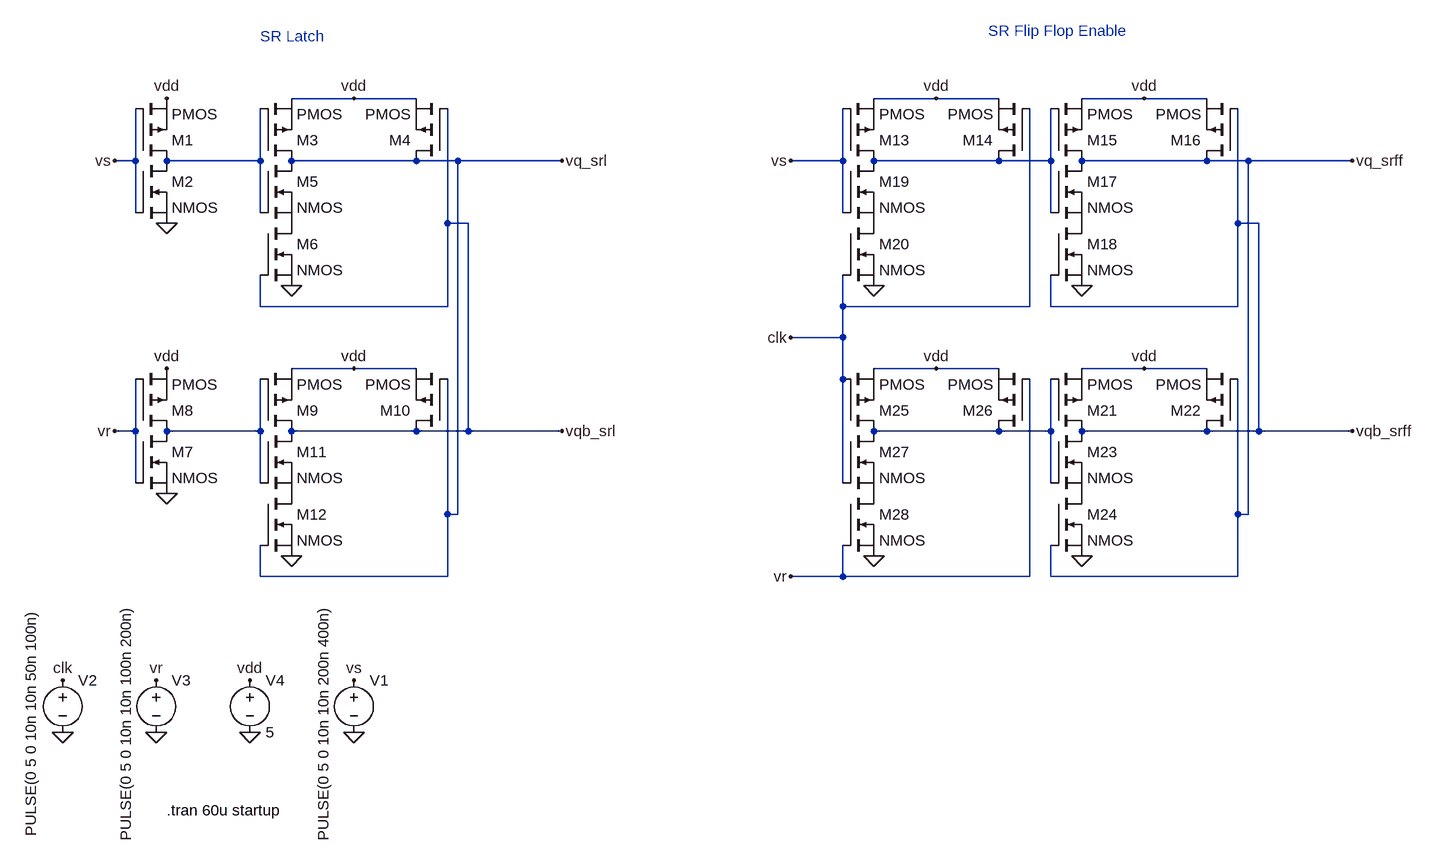
[diagram p0: schematic Basic Memory Device.asc]
Basic Memory Device.asc, the LTspice schematic file:
Version 4.1
SHEET 1 3060 1216
WIRE 336 48 240 48
WIRE 432 48 336 48
WIRE 1232 48 1136 48
WIRE 1328 48 1232 48
WIRE 1552 48 1456 48
WIRE 1648 48 1552 48
WIRE 0 144 0 64
WIRE 0 144 -32 144
WIRE 192 144 192 64
WIRE 192 144 48 144
WIRE 432 144 240 144
WIRE 496 144 432 144
WIRE 656 144 496 144
WIRE 1088 144 1088 64
WIRE 1088 144 1008 144
WIRE 1328 144 1136 144
WIRE 1408 144 1408 64
WIRE 1408 144 1328 144
WIRE 1648 144 1456 144
WIRE 1712 144 1648 144
WIRE 1872 144 1712 144
WIRE 0 224 0 144
WIRE 192 224 192 144
WIRE 1088 224 1088 144
WIRE 1408 224 1408 144
WIRE 480 240 480 64
WIRE 512 240 480 240
WIRE 1696 240 1696 64
WIRE 1728 240 1696 240
WIRE 192 368 192 320
WIRE 480 368 480 240
WIRE 480 368 192 368
WIRE 1088 368 1088 320
WIRE 1376 368 1376 64
WIRE 1376 368 1088 368
WIRE 1408 368 1408 320
WIRE 1696 368 1696 240
WIRE 1696 368 1408 368
WIRE 1088 416 1088 368
WIRE 1088 416 1008 416
WIRE 336 464 240 464
WIRE 432 464 336 464
WIRE 1232 464 1136 464
WIRE 1328 464 1232 464
WIRE 1552 464 1456 464
WIRE 1648 464 1552 464
WIRE 1088 480 1088 416
WIRE 0 560 0 480
WIRE 0 560 -32 560
WIRE 192 560 192 480
WIRE 192 560 48 560
WIRE 432 560 240 560
WIRE 512 560 512 240
WIRE 512 560 432 560
WIRE 656 560 512 560
WIRE 1328 560 1136 560
WIRE 1408 560 1408 480
WIRE 1408 560 1328 560
WIRE 1648 560 1456 560
WIRE 1728 560 1728 240
WIRE 1728 560 1648 560
WIRE 1872 560 1728 560
WIRE 0 640 0 560
WIRE 192 640 192 560
WIRE 1088 640 1088 480
WIRE 1408 640 1408 560
WIRE 480 688 480 480
WIRE 496 688 496 144
WIRE 496 688 480 688
WIRE 1696 688 1696 480
WIRE 1712 688 1712 144
WIRE 1712 688 1696 688
WIRE 192 784 192 736
WIRE 480 784 480 688
WIRE 480 784 192 784
WIRE 1088 784 1088 736
WIRE 1088 784 1008 784
WIRE 1376 784 1376 480
WIRE 1376 784 1088 784
WIRE 1408 784 1408 736
WIRE 1696 784 1696 688
WIRE 1696 784 1408 784
FLAG 48 240 0
FLAG 240 336 0
FLAG 48 656 0
FLAG 240 752 0
FLAG -112 1024 0
FLAG 32 1024 0
FLAG 176 1024 0
FLAG 32 944 vr
FLAG -32 560 vr
FLAG -32 144 vs
FLAG 48 48 vdd
FLAG 336 48 vdd
FLAG 336 464 vdd
FLAG 48 464 vdd
FLAG 176 944 vdd
FLAG 656 144 vq_srl
FLAG 656 560 vqb_srl
FLAG 1456 336 0
FLAG 1456 752 0
FLAG 1552 48 vdd
FLAG 1552 464 vdd
FLAG 1872 144 vq_srff
FLAG 1872 560 vqb_srff
FLAG 1136 336 0
FLAG 1136 752 0
FLAG 1232 48 vdd
FLAG 1232 464 vdd
FLAG 1008 416 clk
FLAG 1008 144 vs
FLAG 1008 784 vr
FLAG 336 1024 0
FLAG 336 944 vs
FLAG -112 944 clk
SYMBOL nmos 0 144 R0
SYMATTR InstName M2
SYMBOL pmos 0 144 M180
SYMATTR InstName M1
SYMBOL pmos 192 144 M180
SYMATTR InstName M3
SYMBOL pmos 480 144 R180
SYMATTR InstName M4
SYMBOL nmos 192 144 R0
SYMATTR InstName M5
SYMBOL nmos 192 240 R0
SYMATTR InstName M6
SYMBOL nmos 0 560 R0
SYMATTR InstName M7
SYMBOL pmos 0 560 M180
SYMATTR InstName M8
SYMBOL pmos 192 560 M180
SYMATTR InstName M9
SYMBOL pmos 480 560 R180
SYMATTR InstName M10
SYMBOL nmos 192 560 R0
SYMATTR InstName M11
SYMBOL nmos 192 656 R0
SYMATTR InstName M12
SYMBOL voltage -112 928 R0
WINDOW 3 -49 -95 VRight 2
WINDOW 123 0 0 Left 0
WINDOW 39 0 0 Left 0
SYMATTR InstName V2
SYMATTR Value PULSE(0 5 0 10n 10n 50n 100n)
SYMBOL voltage 32 928 R0
WINDOW 3 -47 -101 VRight 2
WINDOW 123 0 0 Left 0
WINDOW 39 0 0 Left 0
SYMATTR InstName V3
SYMATTR Value PULSE(0 5 0 10n 10n 100n 200n)
SYMBOL voltage 176 928 R0
WINDOW 123 0 0 Left 0
WINDOW 39 0 0 Left 0
SYMATTR InstName V4
SYMATTR Value 5
SYMBOL pmos 1408 144 M180
SYMATTR InstName M15
SYMBOL pmos 1696 144 R180
SYMATTR InstName M16
SYMBOL nmos 1408 144 R0
SYMATTR InstName M17
SYMBOL nmos 1408 240 R0
SYMATTR InstName M18
SYMBOL pmos 1408 560 M180
SYMATTR InstName M21
SYMBOL pmos 1696 560 R180
SYMATTR InstName M22
SYMBOL nmos 1408 560 R0
SYMATTR InstName M23
SYMBOL nmos 1408 656 R0
SYMATTR InstName M24
SYMBOL pmos 1088 144 M180
SYMATTR InstName M13
SYMBOL pmos 1376 144 R180
SYMATTR InstName M14
SYMBOL nmos 1088 144 R0
SYMATTR InstName M19
SYMBOL nmos 1088 240 R0
SYMATTR InstName M20
SYMBOL pmos 1088 560 M180
SYMATTR InstName M25
SYMBOL pmos 1376 560 R180
SYMATTR InstName M26
SYMBOL nmos 1088 560 R0
SYMATTR InstName M27
SYMBOL nmos 1088 656 R0
SYMATTR InstName M28
SYMBOL voltage 336 928 R0
WINDOW 3 -47 -101 VRight 2
WINDOW 123 0 0 Left 0
WINDOW 39 0 0 Left 0
SYMATTR InstName V1
SYMATTR Value PULSE(0 5 0 10n 10n 200n 400n)
TEXT 48 1144 Left 2 !.tran 60u startup
TEXT 192 -48 Left 2 ;SR Latch
TEXT 1312 -56 Left 2 ;SR Flip Flop Enable

The netlist it stands for:
* Basic Memory Device.asc
M2 N001 vs 0 0 NMOS
M1 N001 vs vdd vdd PMOS
M3 vq_srl N001 vdd vdd PMOS
M4 vq_srl vqb_srl vdd vdd PMOS
M5 vq_srl N001 P001 P001 NMOS
M6 P001 vqb_srl 0 0 NMOS
M7 N003 vr 0 0 NMOS
M8 N003 vr vdd vdd PMOS
M9 vqb_srl N003 vdd vdd PMOS
M10 vqb_srl vq_srl vdd vdd PMOS
M11 vqb_srl N003 P002 P002 NMOS
M12 P002 vq_srl 0 0 NMOS
V2 clk 0 PULSE(0 5 0 10n 10n 50n 100n)
V3 vr 0 PULSE(0 5 0 10n 10n 100n 200n)
V4 vdd 0 5
M15 vq_srff N002 vdd vdd PMOS
M16 vq_srff vqb_srff vdd vdd PMOS
M17 vq_srff N002 P003 P003 NMOS
M18 P003 vqb_srff 0 0 NMOS
M21 vqb_srff N004 vdd vdd PMOS
M22 vqb_srff vq_srff vdd vdd PMOS
M23 vqb_srff N004 P004 P004 NMOS
M24 P004 vq_srff 0 0 NMOS
M13 N002 vs vdd vdd PMOS
M14 N002 clk vdd vdd PMOS
M19 N002 vs P005 P005 NMOS
M20 P005 clk 0 0 NMOS
M25 N004 clk vdd vdd PMOS
M26 N004 vr vdd vdd PMOS
M27 N004 clk P006 P006 NMOS
M28 P006 vr 0 0 NMOS
V1 vs 0 PULSE(0 5 0 10n 10n 200n 400n)
.model NMOS NMOS
.model PMOS PMOS
.lib standard.mos
.tran 60u startup
* SR Latch
* SR Flip Flop Enable
.backanno
.end